# Altium schematic sheet Core Supply Filter.SchDoc (part 1 of 4)
size 420 x 297 mm; Author: ALTIUM GOSTBOM2.0 KEV; SheetNumber: 18; SheetTotal: 48
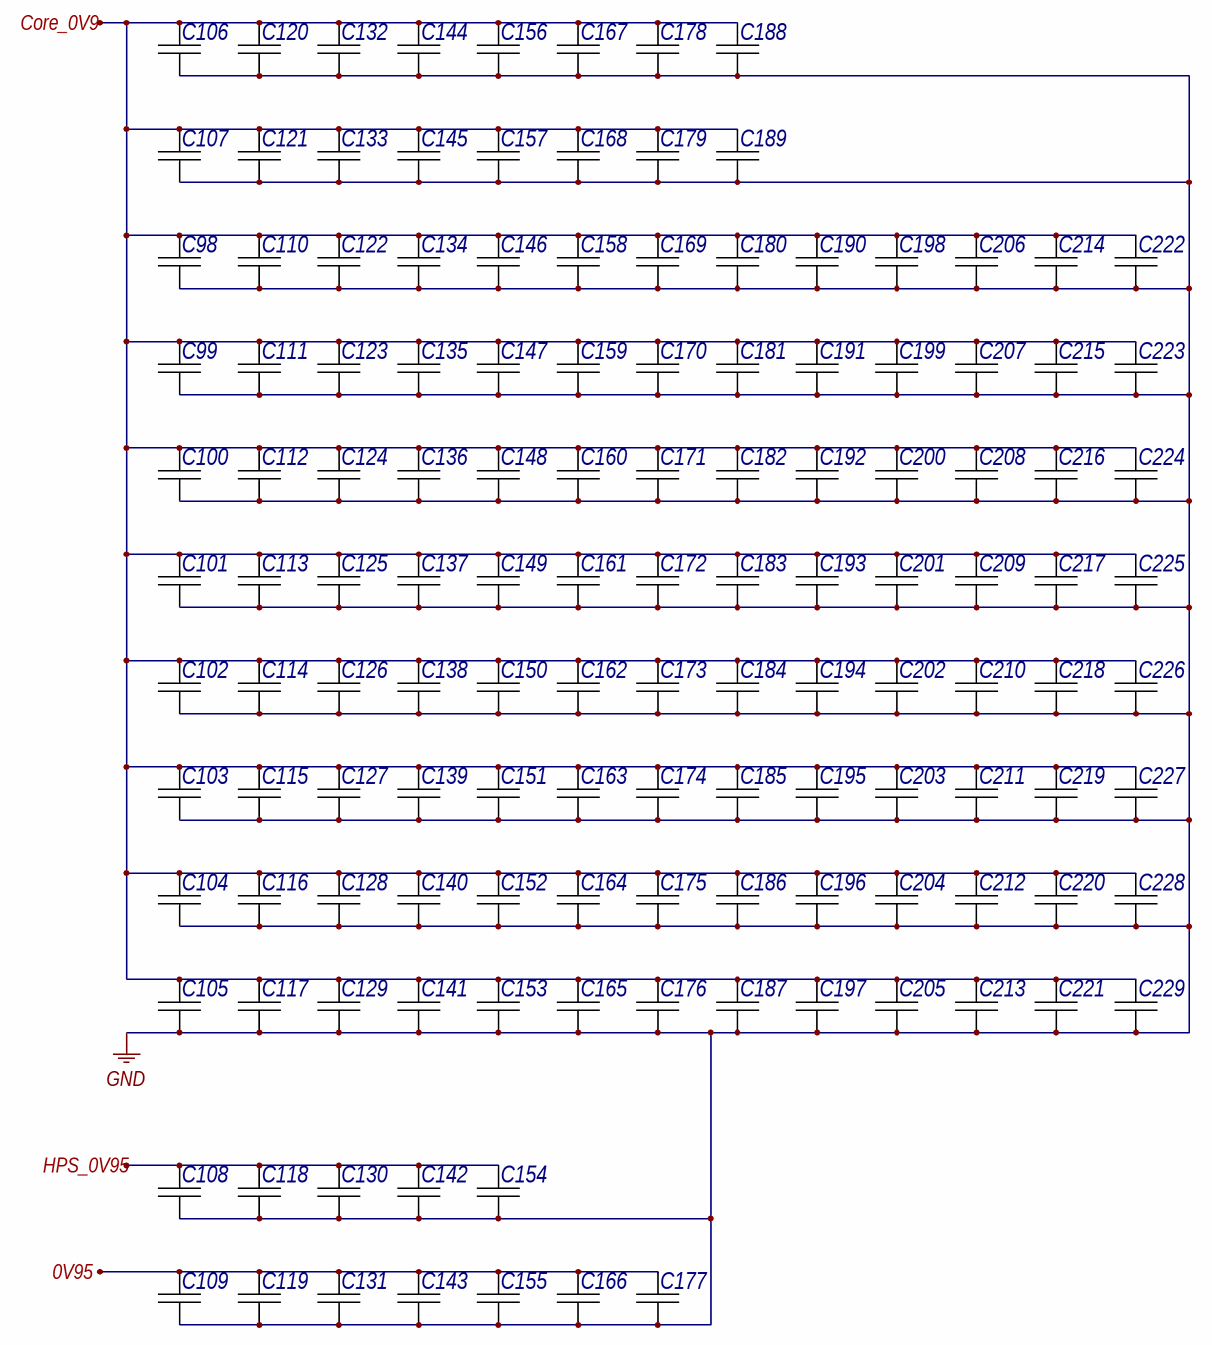
[diagram p0: Core Supply Filter.SchDoc]

## Parts
C98  GRM033R60J104KE19D  [CAPC0603X33X15LL03T05]  (value not drawn)
C99  GRM033R60J104KE19D  [CAPC0603X33X15LL03T05]  (value not drawn)
C100  GRM033R60J104KE19D  [CAPC0603X33X15LL03T05]  (value not drawn)
C101  GRM033R60J104KE19D  [CAPC0603X33X15LL03T05]  (value not drawn)
C102  GRM033R60J104KE19D  [CAPC0603X33X15LL03T05]  (value not drawn)
C103  GRM033R60J104KE19D  [CAPC0603X33X15LL03T05]  (value not drawn)
C104  GRM033R60J104KE19D  [CAPC0603X33X15LL03T05]  (value not drawn)
C105  GRM033R60J104KE19D  [CAPC0603X33X15LL03T05]  (value not drawn)
C106  GRM31CR60J107ME39L  [CAPC3216X190X55ML30T25]  (value not drawn)
C107  GRM31CR60J107ME39L  [CAPC3216X190X55ML30T25]  (value not drawn)
C108  GRM31CR60J107ME39L  [CAPC3216X190X55ML30T25]  (value not drawn)
C109  GRM31CR60J107ME39L  [CAPC3216X190X55ML30T25]  (value not drawn)
C110  GRM033R60J104KE19D  [CAPC0603X33X15LL03T05]  (value not drawn)
C111  GRM033R60J104KE19D  [CAPC0603X33X15LL03T05]  (value not drawn)
C112  GRM033R60J104KE19D  [CAPC0603X33X15LL03T05]  (value not drawn)
C113  GRM033R60J104KE19D  [CAPC0603X33X15LL03T05]  (value not drawn)
C114  GRM033R60J104KE19D  [CAPC0603X33X15LL03T05]  (value not drawn)
C115  GRM033R60J104KE19D  [CAPC0603X33X15LL03T05]  (value not drawn)
C116  GRM033R60J104KE19D  [CAPC0603X33X15LL03T05]  (value not drawn)
C117  GRM033R60J104KE19D  [CAPC0603X33X15LL03T05]  (value not drawn)
C118  GRM033R60J104KE19D  [CAPC0603X33X15LL03T05]  (value not drawn)
C119  GRM033R60J104KE19D  [CAPC0603X33X15LL03T05]  (value not drawn)
C120  GRM31CR60J107ME39L  [CAPC3216X190X55ML30T25]  (value not drawn)
C121  GRM31CR60J107ME39L  [CAPC3216X190X55ML30T25]  (value not drawn)
C122  GRM033R60J104KE19D  [CAPC0603X33X15LL03T05]  (value not drawn)
C123  GRM033R60J104KE19D  [CAPC0603X33X15LL03T05]  (value not drawn)
C124  GRM033R60J104KE19D  [CAPC0603X33X15LL03T05]  (value not drawn)
C125  GRM033R60J104KE19D  [CAPC0603X33X15LL03T05]  (value not drawn)
C126  GRM033R60J104KE19D  [CAPC0603X33X15LL03T05]  (value not drawn)
C127  GRM033R60J104KE19D  [CAPC0603X33X15LL03T05]  (value not drawn)
C128  GRM033R60J104KE19D  [CAPC0603X33X15LL03T05]  (value not drawn)
C129  GRM033R60J104KE19D  [CAPC0603X33X15LL03T05]  (value not drawn)
C130  GRM033R60J104KE19D  [CAPC0603X33X15LL03T05]  (value not drawn)
C131  GRM033R60J104KE19D  [CAPC0603X33X15LL03T05]  (value not drawn)
C132  GRM31CR60J107ME39L  [CAPC3216X190X55ML30T25]  (value not drawn)
C133  GRM31CR60J107ME39L  [CAPC3216X190X55ML30T25]  (value not drawn)
C134  GRM033R60J104KE19D  [CAPC0603X33X15LL03T05]  (value not drawn)
C135  GRM033R60J104KE19D  [CAPC0603X33X15LL03T05]  (value not drawn)
C136  GRM033R60J104KE19D  [CAPC0603X33X15LL03T05]  (value not drawn)
C137  GRM033R60J104KE19D  [CAPC0603X33X15LL03T05]  (value not drawn)
C138  GRM033R60J104KE19D  [CAPC0603X33X15LL03T05]  (value not drawn)
C139  GRM033R60J104KE19D  [CAPC0603X33X15LL03T05]  (value not drawn)
C140  GRM033R60J104KE19D  [CAPC0603X33X15LL03T05]  (value not drawn)
C141  GRM033R60J104KE19D  [CAPC0603X33X15LL03T05]  (value not drawn)
C142  GRM033R60J104KE19D  [CAPC0603X33X15LL03T05]  (value not drawn)
C143  GRM033R60J104KE19D  [CAPC0603X33X15LL03T05]  (value not drawn)
C144  GRM31CR60J107ME39L  [CAPC3216X190X55ML30T25]  (value not drawn)
C145  GRM31CR60J107ME39L  [CAPC3216X190X55ML30T25]  (value not drawn)
C146  GRM033R60J104KE19D  [CAPC0603X33X15LL03T05]  (value not drawn)
C147  GRM033R60J104KE19D  [CAPC0603X33X15LL03T05]  (value not drawn)
C148  GRM033R60J104KE19D  [CAPC0603X33X15LL03T05]  (value not drawn)
C149  GRM033R60J104KE19D  [CAPC0603X33X15LL03T05]  (value not drawn)
C150  GRM033R60J104KE19D  [CAPC0603X33X15LL03T05]  (value not drawn)
C151  GRM033R60J104KE19D  [CAPC0603X33X15LL03T05]  (value not drawn)
C152  GRM033R60J104KE19D  [CAPC0603X33X15LL03T05]  (value not drawn)
C153  GRM033R60J104KE19D  [CAPC0603X33X15LL03T05]  (value not drawn)
C154  GRM033R60J104KE19D  [CAPC0603X33X15LL03T05]  (value not drawn)
C155  GRM033R60J104KE19D  [CAPC0603X33X15LL03T05]  (value not drawn)
C156  GRM31CR60J107ME39L  [CAPC3216X190X55ML30T25]  (value not drawn)
C157  GRM31CR60J107ME39L  [CAPC3216X190X55ML30T25]  (value not drawn)
C158  GRM033R60J104KE19D  [CAPC0603X33X15LL03T05]  (value not drawn)
C159  GRM033R60J104KE19D  [CAPC0603X33X15LL03T05]  (value not drawn)
C160  GRM033R60J104KE19D  [CAPC0603X33X15LL03T05]  (value not drawn)
C161  GRM033R60J104KE19D  [CAPC0603X33X15LL03T05]  (value not drawn)
C162  GRM033R60J104KE19D  [CAPC0603X33X15LL03T05]  (value not drawn)
C163  GRM033R60J104KE19D  [CAPC0603X33X15LL03T05]  (value not drawn)
C164  GRM033R60J104KE19D  [CAPC0603X33X15LL03T05]  (value not drawn)
C165  GRM033R60J104KE19D  [CAPC0603X33X15LL03T05]  (value not drawn)
C166  GRM033R60J104KE19D  [CAPC0603X33X15LL03T05]  (value not drawn)
C167  GRM31CR60J107ME39L  [CAPC3216X190X55ML30T25]  (value not drawn)
C168  GRM31CR60J107ME39L  [CAPC3216X190X55ML30T25]  (value not drawn)
C169  GRM033R60J104KE19D  [CAPC0603X33X15LL03T05]  (value not drawn)
C170  GRM033R60J104KE19D  [CAPC0603X33X15LL03T05]  (value not drawn)
C171  GRM033R60J104KE19D  [CAPC0603X33X15LL03T05]  (value not drawn)
C172  GRM033R60J104KE19D  [CAPC0603X33X15LL03T05]  (value not drawn)
C173  GRM033R60J104KE19D  [CAPC0603X33X15LL03T05]  (value not drawn)
C174  GRM033R60J104KE19D  [CAPC0603X33X15LL03T05]  (value not drawn)
C175  GRM033R60J104KE19D  [CAPC0603X33X15LL03T05]  (value not drawn)
C176  GRM033R60J104KE19D  [CAPC0603X33X15LL03T05]  (value not drawn)
C177  GRM033R60J104KE19D  [CAPC0603X33X15LL03T05]  (value not drawn)
C178  GRM31CR60J107ME39L  [CAPC3216X190X55ML30T25]  (value not drawn)
C179  GRM31CR60J107ME39L  [CAPC3216X190X55ML30T25]  (value not drawn)
C180  GRM033R60J104KE19D  [CAPC0603X33X15LL03T05]  (value not drawn)
C181  GRM033R60J104KE19D  [CAPC0603X33X15LL03T05]  (value not drawn)
C182  GRM033R60J104KE19D  [CAPC0603X33X15LL03T05]  (value not drawn)
C183  GRM033R60J104KE19D  [CAPC0603X33X15LL03T05]  (value not drawn)
C184  GRM033R60J104KE19D  [CAPC0603X33X15LL03T05]  (value not drawn)
C185  GRM033R60J104KE19D  [CAPC0603X33X15LL03T05]  (value not drawn)
C186  GRM033R60J104KE19D  [CAPC0603X33X15LL03T05]  (value not drawn)
C187  GRM033R60J104KE19D  [CAPC0603X33X15LL03T05]  (value not drawn)
C188  GRM31CR60J107ME39L  [CAPC3216X190X55ML30T25]  (value not drawn)
C189  GRM31CR60J107ME39L  [CAPC3216X190X55ML30T25]  (value not drawn)
C190  GRM033R60J104KE19D  [CAPC0603X33X15LL03T05]  (value not drawn)
C191  GRM033R60J104KE19D  [CAPC0603X33X15LL03T05]  (value not drawn)
C192  GRM033R60J104KE19D  [CAPC0603X33X15LL03T05]  (value not drawn)
C193  GRM033R60J104KE19D  [CAPC0603X33X15LL03T05]  (value not drawn)
C194  GRM033R60J104KE19D  [CAPC0603X33X15LL03T05]  (value not drawn)
C195  GRM033R60J104KE19D  [CAPC0603X33X15LL03T05]  (value not drawn)
C196  GRM033R60J104KE19D  [CAPC0603X33X15LL03T05]  (value not drawn)
C197  GRM033R60J104KE19D  [CAPC0603X33X15LL03T05]  (value not drawn)
C198  GRM033R60J104KE19D  [CAPC0603X33X15LL03T05]  (value not drawn)
C199  GRM033R60J104KE19D  [CAPC0603X33X15LL03T05]  (value not drawn)
C200  GRM033R60J104KE19D  [CAPC0603X33X15LL03T05]  (value not drawn)
C201  GRM033R60J104KE19D  [CAPC0603X33X15LL03T05]  (value not drawn)
C202  GRM033R60J104KE19D  [CAPC0603X33X15LL03T05]  (value not drawn)
C203  GRM033R60J104KE19D  [CAPC0603X33X15LL03T05]  (value not drawn)
C204  GRM033R60J104KE19D  [CAPC0603X33X15LL03T05]  (value not drawn)
C205  GRM033R60J104KE19D  [CAPC0603X33X15LL03T05]  (value not drawn)
C206  GRM033R60J104KE19D  [CAPC0603X33X15LL03T05]  (value not drawn)
C207  GRM033R60J104KE19D  [CAPC0603X33X15LL03T05]  (value not drawn)
C208  GRM033R60J104KE19D  [CAPC0603X33X15LL03T05]  (value not drawn)
C209  GRM033R60J104KE19D  [CAPC0603X33X15LL03T05]  (value not drawn)
C210  GRM033R60J104KE19D  [CAPC0603X33X15LL03T05]  (value not drawn)
C211  GRM033R60J104KE19D  [CAPC0603X33X15LL03T05]  (value not drawn)
C212  GRM033R60J104KE19D  [CAPC0603X33X15LL03T05]  (value not drawn)
C213  GRM033R60J104KE19D  [CAPC0603X33X15LL03T05]  (value not drawn)
C214  GRM033R60J104KE19D  [CAPC0603X33X15LL03T05]  (value not drawn)
C215  GRM033R60J104KE19D  [CAPC0603X33X15LL03T05]  (value not drawn)
C216  GRM033R60J104KE19D  [CAPC0603X33X15LL03T05]  (value not drawn)
C217  GRM033R60J104KE19D  [CAPC0603X33X15LL03T05]  (value not drawn)
C218  GRM033R60J104KE19D  [CAPC0603X33X15LL03T05]  (value not drawn)
C219  GRM033R60J104KE19D  [CAPC0603X33X15LL03T05]  (value not drawn)
C220  GRM033R60J104KE19D  [CAPC0603X33X15LL03T05]  (value not drawn)
C221  GRM033R60J104KE19D  [CAPC0603X33X15LL03T05]  (value not drawn)
C222  GRM033R60J104KE19D  [CAPC0603X33X15LL03T05]  (value not drawn)
C223  GRM033R60J104KE19D  [CAPC0603X33X15LL03T05]  (value not drawn)
C224  GRM033R60J104KE19D  [CAPC0603X33X15LL03T05]  (value not drawn)
C225  GRM033R60J104KE19D  [CAPC0603X33X15LL03T05]  (value not drawn)
C226  GRM033R60J104KE19D  [CAPC0603X33X15LL03T05]  (value not drawn)
C227  GRM033R60J104KE19D  [CAPC0603X33X15LL03T05]  (value not drawn)
C228  GRM033R60J104KE19D  [CAPC0603X33X15LL03T05]  (value not drawn)
C229  GRM033R60J104KE19D  [CAPC0603X33X15LL03T05]  (value not drawn)

## Ports
0V95, Core_0V9, HPS_0V95

## Nets
GND: C98.1 C99.1 C100.1 C101.1 C102.1 C103.1 C104.1 C105.1 C106.1 C107.1 C108.1 C109.1 C110.1 C111.1 C112.1 C113.1 C114.1 C115.1 C116.1 C117.1 C118.1 C119.1 C120.1 C121.1 C122.1 C123.1 C124.1 C125.1 C126.1 C127.1 C128.1 C129.1 C130.1 C131.1 C132.1 C133.1 C134.1 C135.1 C136.1 C137.1 C138.1 C139.1 C140.1 C141.1 C142.1 C143.1 C144.1 C145.1 C146.1 C147.1 C148.1 C149.1 C150.1 C151.1 C152.1 C153.1 C154.1 C155.1 C156.1 C157.1 C158.1 C159.1 C160.1 C161.1 C162.1 C163.1 C164.1 C165.1 C166.1 C167.1 C168.1 C169.1 C170.1 C171.1 C172.1 C173.1 C174.1 C175.1 C176.1 C177.1 C178.1 C179.1 C180.1 C181.1 C182.1 C183.1 C184.1 C185.1 C186.1 C187.1 C188.1 C189.1 C190.1 C191.1 C192.1 C193.1 C194.1 C195.1 C196.1 C197.1 C198.1 C199.1 C200.1 C201.1 C202.1 C203.1 C204.1 C205.1 C206.1 C207.1 C208.1 C209.1 C210.1 C211.1 C212.1 C213.1 C214.1 C215.1 C216.1 C217.1 C218.1 C219.1 C220.1 C221.1 C222.1 C223.1 C224.1 C225.1 C226.1 C227.1 C228.1 C229.1
0V95: C109.2 C119.2 C131.2 C143.2 C155.2 C166.2 C177.2 ; port 0V95
Core_0V9: C98.2 C99.2 C100.2 C101.2 C102.2 C103.2 C104.2 C105.2 C106.2 C107.2 C110.2 C111.2 C112.2 C113.2 C114.2 C115.2 C116.2 C117.2 C120.2 C121.2 C122.2 C123.2 C124.2 C125.2 C126.2 C127.2 C128.2 C129.2 C132.2 C133.2 C134.2 C135.2 C136.2 C137.2 C138.2 C139.2 C140.2 C141.2 C144.2 C145.2 C146.2 C147.2 C148.2 C149.2 C150.2 C151.2 C152.2 C153.2 C156.2 C157.2 C158.2 C159.2 C160.2 C161.2 C162.2 C163.2 C164.2 C165.2 C167.2 C168.2 C169.2 C170.2 C171.2 C172.2 C173.2 C174.2 C175.2 C176.2 C178.2 C179.2 C180.2 C181.2 C182.2 C183.2 C184.2 C185.2 C186.2 C187.2 C188.2 C189.2 C190.2 C191.2 C192.2 C193.2 C194.2 C195.2 C196.2 C197.2 C198.2 C199.2 C200.2 C201.2 C202.2 C203.2 C204.2 C205.2 C206.2 C207.2 C208.2 C209.2 C210.2 C211.2 C212.2 C213.2 C214.2 C215.2 C216.2 C217.2 C218.2 C219.2 C220.2 C221.2 C222.2 C223.2 C224.2 C225.2 C226.2 C227.2 C228.2 C229.2 ; port Core_0V9
HPS_0V95: C108.2 C118.2 C130.2 C142.2 C154.2 ; port HPS_0V95

## Notes on the sheet
- Подп. дата
- Инв. № дубл.
- Взам. инв. №
- Подп. и дата
- Инв. № подл.
- Изм.
- Лист
- № докум.
- Подп.
- Дата
- ALTIUM GOSTBOM2.0 KEV
- Файл:
- Копировал
- Формат А3